# Altium schematic sheet FE1.1S-SCH.SchDoc
size A3
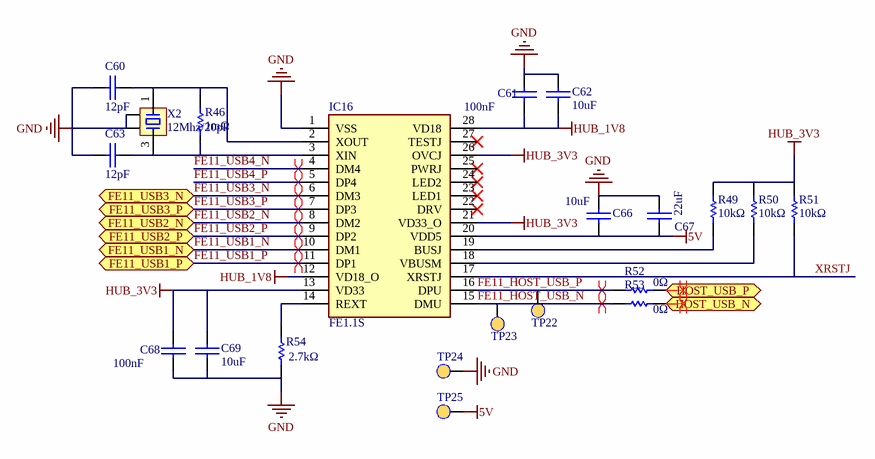
[diagram p0: FE1.1S-SCH.SchDoc]

## Parts
C60  12pF  [C_0402]
C61  100nF  [C_0402]
C62  10uF  [C_0603]
C63  12pF  [C_0402]
C66  10uF  [C_0603]
C67  22uF  [C_0805]
C68  100nF  [C_0402]
C69  10uF  [C_0603]
IC16  FE1.1S  [SSOP-28N-150MIL]
R46  1mΩ  [R_0402]
R49  10kΩ  [R_0402]
R50  10kΩ  [R_0402]
R51  10kΩ  [R_0402]
R52  0Ω  [R_0603]
R53  0Ω  [R_0603]
R54  2.7kΩ  [R_0402]
TP22  TP  [TP1.4mm]  (value not drawn)
TP23  TP  [TP1.4mm]  (value not drawn)
TP24  TP  [TP1.4mm]  (value not drawn)
TP25  TP  [TP1.4mm]  (value not drawn)
X2  12Mhz/20pF  [XTAL_3225-4P]

## Ports
FE11_USB1_N (bidir), FE11_USB1_P (bidir), FE11_USB2_N (bidir), FE11_USB2_P (bidir), FE11_USB3_N (bidir), FE11_USB3_P (bidir), HOST_USB_N (bidir), HOST_USB_P (bidir)

## Nets
5V: C66.2 C67.1 IC16.20(VDD5) TP25.1(TP)
GND: C60.2 C61.2 C62.1 C63.1 C66.1 C67.2 C68.1 C69.2 IC16.1(VSS) R54.1 TP24.1(TP) X2.2 X2.4
HUB_1V8: C61.1 C62.2 IC16.12(VD18_O) IC16.28(VD18)
HUB_3V3: C68.2 C69.1 IC16.13(VD33) IC16.21(VD33_O) IC16.26(OVCJ) R49.2 R50.2 R51.2
FE11_HOST_USB_N: IC16.15(DMU) R53.2 TP23.1(TP)
FE11_HOST_USB_P: IC16.16(DPU) R52.2 TP22.1(TP)
FE11_USB1_N: IC16.10(DM1) ; port FE11_USB1_N
FE11_USB1_P: IC16.11(DP1) ; port FE11_USB1_P
FE11_USB2_N: IC16.8(DM2) ; port FE11_USB2_N
FE11_USB2_P: IC16.9(DP2) ; port FE11_USB2_P
FE11_USB3_N: IC16.6(DM3) ; port FE11_USB3_N
FE11_USB3_P: IC16.7(DP3) ; port FE11_USB3_P
FE11_USB4_N: IC16.4(DM4)
FE11_USB4_P: IC16.5(DP4)
HOST_USB_N: R53.1 ; port HOST_USB_N
HOST_USB_P: R52.1 ; port HOST_USB_P
XRSTJ: IC16.17(XRSTJ) R51.1
NetC60_1: C60.1 IC16.2(XOUT) R46.2 X2.1
NetC63_2: C63.2 IC16.3(XIN) R46.1 X2.3
NetIC16_14: IC16.14(REXT) R54.2
NetIC16_18: IC16.18(VBUSM) R50.1
NetIC16_19: IC16.19(BUSJ) R49.1

Not connected (* = marked no-connect by the designer): IC16 22(DRV)* 23(LED1)* 24(LED2)* 25(PWRJ)* 27(TESTJ)*

## Layout directives
differential pair: FE11_HOST_USB_N, FE11_HOST_USB_P, FE11_USB1_N, FE11_USB1_P, FE11_USB2_N, FE11_USB2_P, FE11_USB3_N, FE11_USB3_P, FE11_USB4_N, FE11_USB4_P, HOST_USB_N, HOST_USB_P

## Library data of the parts
C60 C63 = Cap_Chip: 贴片电容; Manufacturer_Name: SAMSUNG(三星); Manufacturer_Part_Number: ±5% /25V; Manufacturer_Name_1: YAGEO(国巨); Manufacturer_Part_Number_1: ±5% /25V
C61 C62 C66-C69 = Cap_Chip: 贴片电容; Manufacturer_Name: SAMSUNG(三星); Manufacturer_Part_Number: ±10% /25V; Manufacturer_Name_1: YAGEO(国巨); Manufacturer_Part_Number_1: ±10% /25V
IC16 = FE1.1S: USB2.0 Hub 4口芯片; Manufacturer_Name: TERMINUS; Manufacturer_Part_Number: FE1.1S-BSOP28BCN; LCSC: C9359
R46 R49-R54 = Res_Chip: 贴片电阻; Manufacturer_Name: UNI-ROYAL(厚声); Manufacturer_Part_Number: ±1%; Manufacturer_Name_1: YAGEO(国巨); Manufacturer_Part_Number_1: ±1%
TP22-TP25 = TP: 测试点
X2 = Crystal_4P: 4脚无源晶振; Manufacturer_Name: *; Manufacturer_Part_Number: *